# Altium schematic sheet Inverter.SchDoc (part 1 of 2)
size A3; SheetNumber: 7; SheetTotal: 9
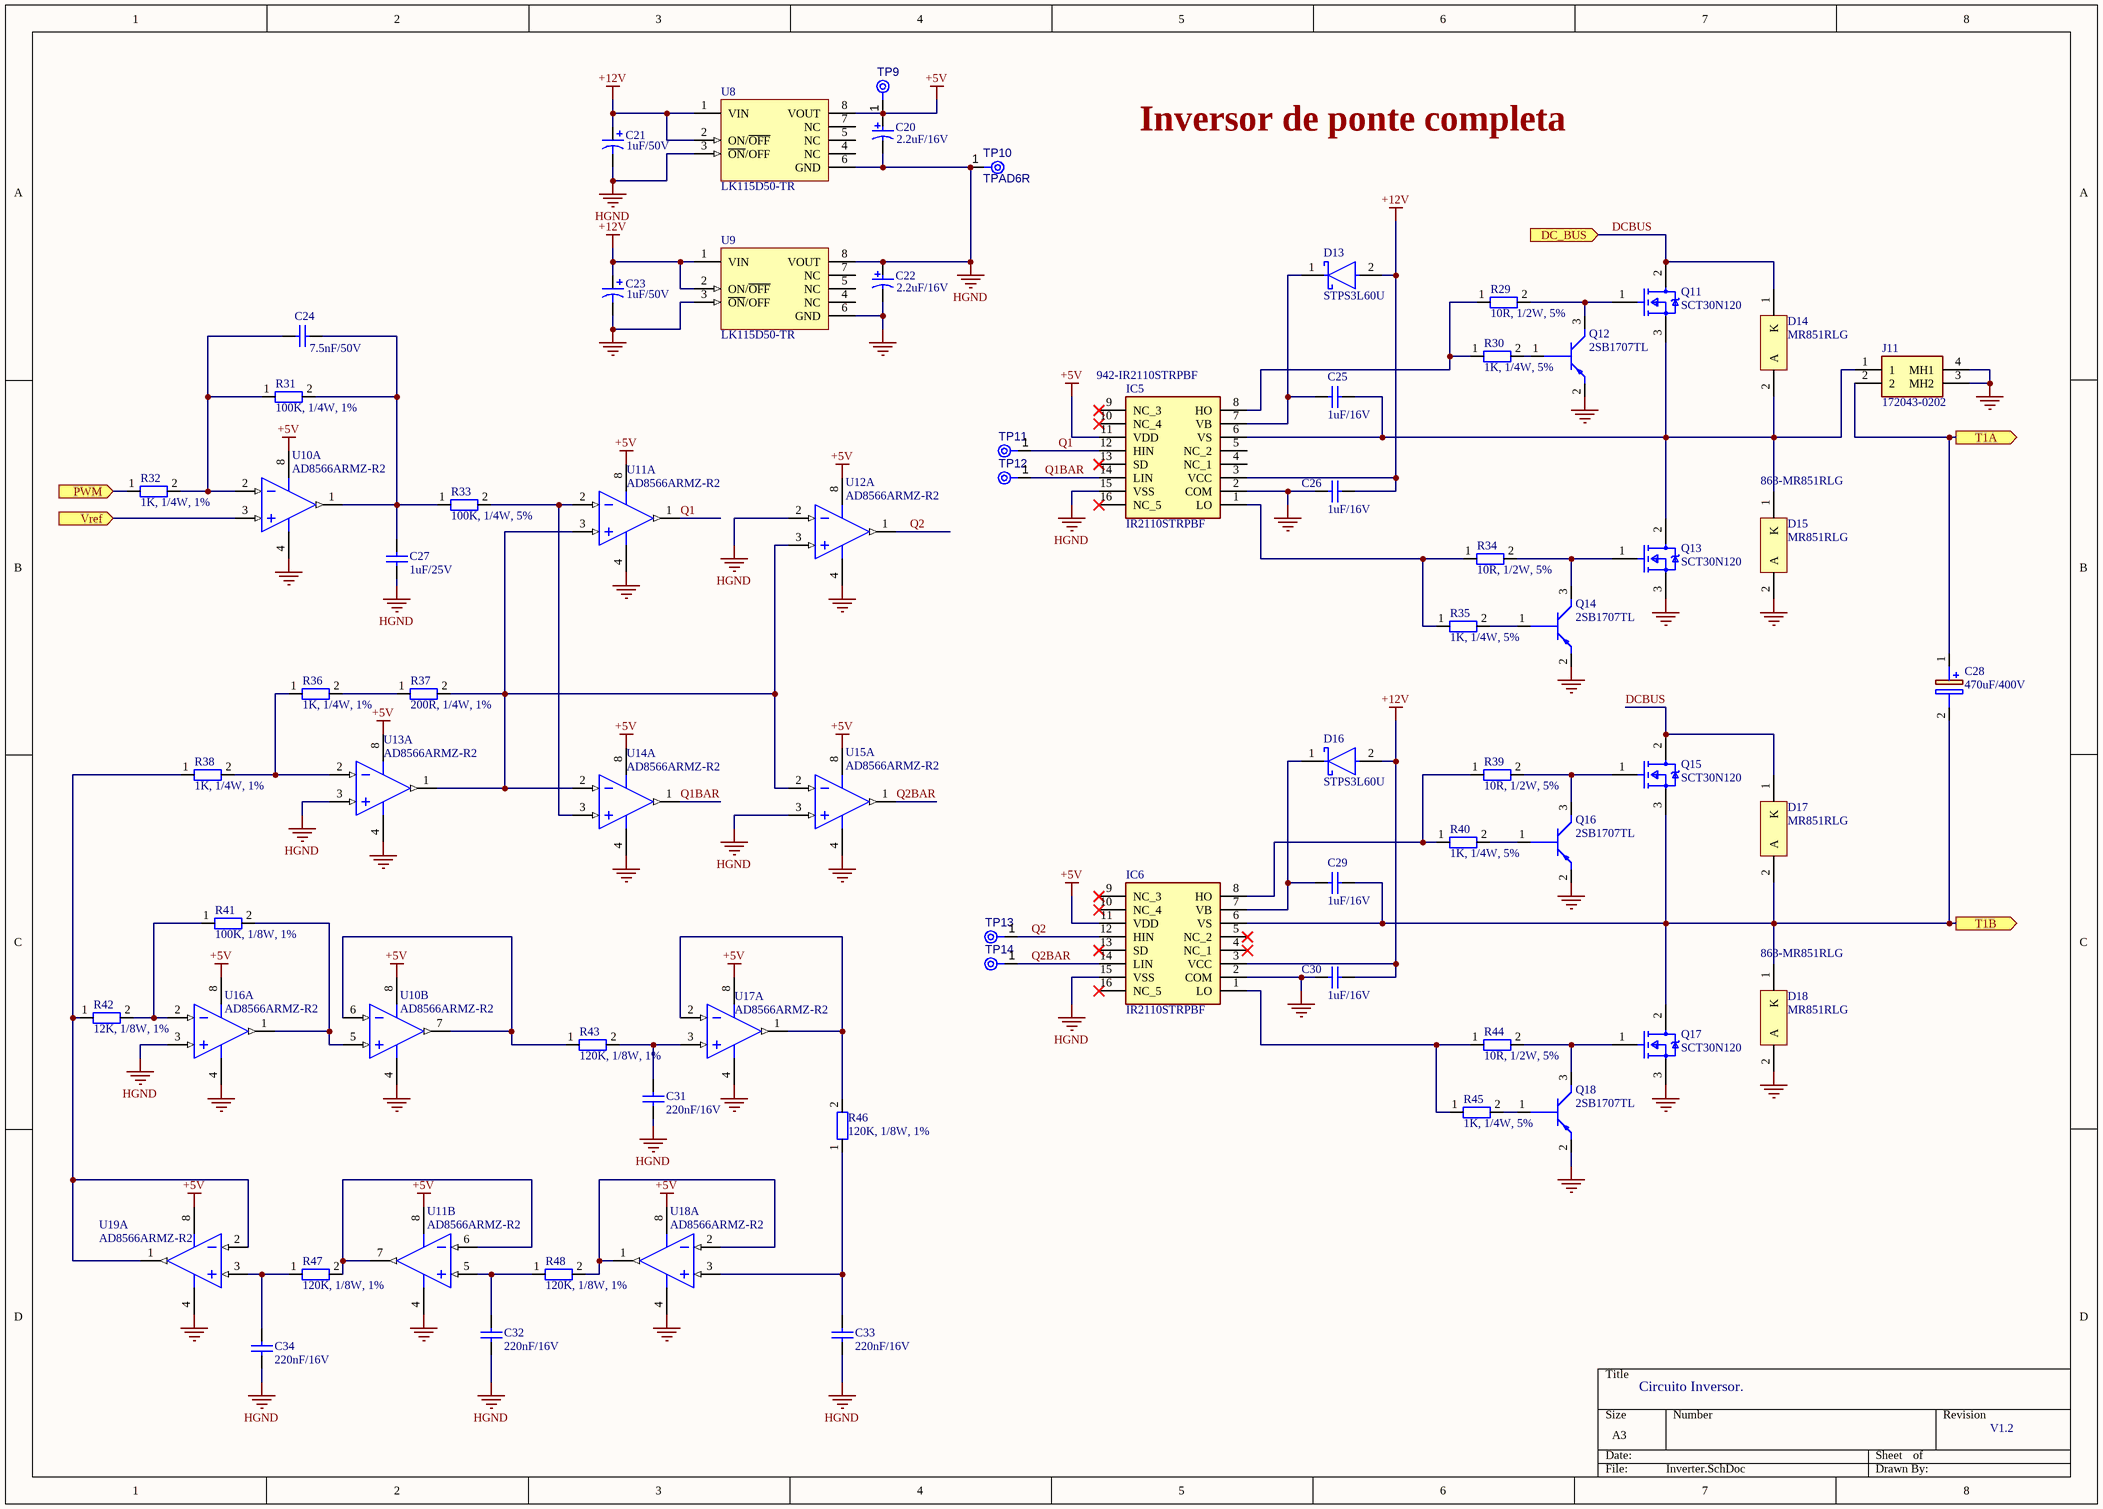
[diagram p0: Inverter.SchDoc]

## Parts
C20  2.2uF/16V  [KEMT-T491-A_L]
C21  value 1uF/50V  [C1206]  (hidden comment: Cap Pol1)
C22  2.2uF/16V  [KEMT-T491-A_L]
C23  value 1uF/50V  [C1206]  (hidden comment: Cap Pol1)
C24  7.5nF/50V  [CAPC2013X135X45LL10T25]
C25  1uF/16V  [CAPC2013X140X50ML20T25]
C26  1uF/16V  [CAPC2013X140X50ML20T25]
C27  1uF/25V  [CAPC2013X135X45LL10T25]
C28  470uF/400V  [CAPPRD1000W210D3500H3700]
C29  1uF/16V  [CAPC2013X140X50ML20T25]
C30  1uF/16V  [CAPC2013X140X50ML20T25]
C31  220nF/16V  [CAPC2013X135X45LL10T25]
C32  220nF/16V  [CAPC2013X135X45LL10T25]
C33  220nF/16V  [CAPC2013X135X45LL10T25]
C34  220nF/16V  [CAPC2013X135X45LL10T25]
D13  STPS3L60U  [FP-SMB-MFG]
D14  MR851RLG  [ONSC-AXIAL_LEAD-2-267-05_V]
D15  MR851RLG  Supplier Part Number 1: 863-MR851RLG  [ONSC-AXIAL_LEAD-2-267-05_V]
D16  STPS3L60U  [FP-SMB-MFG]
D17  MR851RLG  [ONSC-AXIAL_LEAD-2-267-05_V]
D18  MR851RLG  Supplier Part Number 1: 863-MR851RLG  [ONSC-AXIAL_LEAD-2-267-05_V]
IC5  IR2110STRPBF  Supplier Part Number 1: 942-IR2110STRPBF  [SOIC127P1032X265-16N]
IC6  IR2110STRPBF  [SOIC127P1032X265-16N]
J11  172043-0202  [1720430202]
Q11  SCT30N120  [TO-247-3]
Q12  2SB1707TL  [SOT95P280X100-3N]
Q13  SCT30N120  [TO-247-3]
Q14  2SB1707TL  [SOT95P280X100-3N]
Q15  SCT30N120  [TO-247-3]
Q16  2SB1707TL  [SOT95P280X100-3N]
Q17  SCT30N120  [TO-247-3]
Q18  2SB1707TL  [SOT95P280X100-3N]
R29  10R, 1/2W, 5%  [RESC3216X60N]
R30  1K, 1/4W, 5%  [RES-0805]
R31  100K, 1/4W, 1%  [RES-0805]
R32  1K, 1/4W, 1%  [RES-0805]
R33  100K, 1/4W, 5%  [RES-0805]
R34  10R, 1/2W, 5%  [RESC3216X60N]
R35  1K, 1/4W, 5%  [RES-0805]
R36  1K, 1/4W, 1%  [RES-0805]
R37  200R, 1/4W, 1%  [RES-0805]
R38  1K, 1/4W, 1%  [RES-0805]
R39  10R, 1/2W, 5%  [RESC3216X60N]
R40  1K, 1/4W, 5%  [RES-0805]
R41  100K, 1/8W, 1%  [RES-0805]
R42  12K, 1/8W, 1%  [RES-0805]
R43  120K, 1/8W, 1%  [RES-0805]
R44  10R, 1/2W, 5%  [RESC3216X60N]
R45  1K, 1/4W, 5%  [RES-0805]
R46  120K, 1/8W, 1%  [RES-0805]
R47  120K, 1/8W, 1%  [RES-0805]
R48  120K, 1/8W, 1%  [RES-0805]
TP9  TPAD6R  [TP06R]  (value not drawn)  (no BOM)
TP10  TPAD6R  [TP06R]  (no BOM)
TP11  TPAD6R  [TP06R]  (value not drawn)  (no BOM)
TP12  TPAD6R  [TP06R]  (value not drawn)  (no BOM)
TP13  TPAD6R  [TP06R]  (value not drawn)  (no BOM)
TP14  TPAD6R  [TP06R]  (value not drawn)  (no BOM)
U8  LK115D50-TR  [SO8_M]
U9  LK115D50-TR  [SO8_M]
U10  AD8566ARMZ-R2  [ADI-RM-8_L]  (parts A,B of 2)
U11  AD8566ARMZ-R2  [ADI-RM-8_L]  (parts A,B of 2)
U12  AD8566ARMZ-R2  [ADI-RM-8_L]  (part A of 2)
U13  AD8566ARMZ-R2  [ADI-RM-8_L]  (part A of 2)
U14  AD8566ARMZ-R2  [ADI-RM-8_L]  (part A of 2)
U15  AD8566ARMZ-R2  [ADI-RM-8_L]  (part A of 2)
U16  AD8566ARMZ-R2  [ADI-RM-8_L]  (part A of 2)
U17  AD8566ARMZ-R2  [ADI-RM-8_L]  (part A of 2)
U18  AD8566ARMZ-R2  [ADI-RM-8_L]  (part A of 2)
U19  AD8566ARMZ-R2  [ADI-RM-8_L]  (part A of 2)

## Ports
DC_BUS (in), PWM (in), T1A (out), T1B (out), Vref (in)

## Nets
+5V: C20.1 IC5.11(VDD) IC6.11(VDD) TP9.1(TP) U8.8(VOUT) U10.8(+V) U11.8(+V) U12.8(+V) U13.8(+V) U14.8(+V) U15.8(+V) U16.8(+V) U17.8(+V) U18.8(+V) U19.8(+V)
+12V: C21.1 C23.1 C26.2 C30.1 D13.2(A) D16.2(A) IC5.3(VCC) IC6.3(VCC) U8.1(VIN) U8.2(ON/~{OFF}) U9.1(VIN) U9.2(ON/~{OFF})
GND: C22.2 C23.2 C26.1 C30.2 D15.2(A) D18.2(A) IC5.2(COM) IC6.2(COM) J11.3(MH2) J11.4(MH1) Q12.2(E) Q13.3(S) Q14.2(E) Q16.2(E) Q17.3(S) Q18.2(E) U9.3(~{ON}/OFF) U9.6(GND) U10.4(-V) U11.4(-V) U12.4(-V) U13.4(-V) U14.4(-V) U15.4(-V) U16.4(-V) U17.4(-V) U18.4(-V) U19.4(-V)
HGND: C20.2 C21.2 C22.1 C27.1 C31.1 C32.1 C33.1 C34.1 IC5.15(VSS) IC6.15(VSS) TP10.1(TP) U8.3(~{ON}/OFF) U8.6(GND) U9.8(VOUT) U12.2(-IN_A) U13.3(+IN_A) U15.3(+IN_A) U16.3(+IN_A)
DCBUS: D14.1(K) D17.1(K) Q11.2(D) Q15.2(D) ; port DC_BUS
PWM: R32.1 ; port PWM
Q1: IC5.12(HIN) TP11.1(TP) U11.1(OUT_A)
Q1BAR: IC5.14(LIN) TP12.1(TP) U14.1(OUT_A)
Q2: IC6.12(HIN) TP13.1(TP) U12.1(OUT_A)
Q2BAR: IC6.14(LIN) TP14.1(TP) U15.1(OUT_A)
T1A: C28.1(+) J11.2 ; port T1A
T1B: C28.2(-) C29.1 D17.2(A) D18.1(K) IC6.6(VS) Q15.3(S) Q17.2(D) ; port T1B
Vref: U10.3(+IN_A) ; port Vref
NetC24_1: C24.1 C27.2 R31.2 R33.1 U10.1(OUT_A)
NetC24_2: C24.2 R31.1 R32.2 U10.2(-IN_A)
NetC25_1: C25.1 D13.1(K) IC5.7(VB)
NetC25_2: C25.2 D14.2(A) D15.1(K) IC5.6(VS) J11.1 Q11.3(S) Q13.2(D)
NetC29_2: C29.2 D16.1(K) IC6.7(VB)
NetC31_2: C31.2 R43.2 U17.3(+IN_A)
NetC32_2: C32.2 R48.1 U11.5(+IN_B)
NetC33_2: C33.2 R46.1 U18.3(+IN_A)
NetC34_2: C34.2 R47.1 U19.3(+IN_A)
NetIC5_1: IC5.1(LO) R34.1 R35.1
NetIC5_8: IC5.8(HO) R29.1 R30.1
NetIC6_1: IC6.1(LO) R44.1 R45.1
NetIC6_8: IC6.8(HO) R39.1 R40.1
NetQ11_1: Q11.1(G) Q12.3(C) R29.2
NetQ12_1: Q12.1(B) R30.2
NetQ13_1: Q13.1(G) Q14.3(C) R34.2
NetQ14_1: Q14.1(B) R35.2
NetQ15_1: Q15.1(G) Q16.3(C) R39.2
NetQ16_1: Q16.1(B) R40.2
NetQ17_1: Q17.1(G) Q18.3(C) R44.2
NetQ18_1: Q18.1(B) R45.2
NetR33_2: R33.2 U11.2(-IN_A) U14.3(+IN_A)
NetR36_1: R36.1 R38.2 U13.2(-IN_A)
NetR36_2: R36.2 R37.1
NetR37_2: R37.2 U11.3(+IN_A) U12.3(+IN_A) U13.1(OUT_A) U14.2(-IN_A) U15.2(-IN_A)
NetR38_1: R38.1 R42.1 U19.1(OUT_A) U19.2(-IN_A)
NetR41_1: R41.1 R42.2 U16.2(-IN_A)
NetR41_2: R41.2 U10.5(+IN_B) U16.1(OUT_A)
NetR43_1: R43.1 U10.6(-IN_B) U10.7(OUT_B)
NetR46_2: R46.2 U17.1(OUT_A) U17.2(-IN_A)
NetR47_2: R47.2 U11.6(-IN_B) U11.7(OUT_B)
NetR48_2: R48.2 U18.1(OUT_A) U18.2(-IN_A)

Not connected (* = marked no-connect by the designer): IC5 4(NC_1) 5(NC_2) 9(NC_3)* 10(NC_4)* 13(SD)* 16(NC_5)*; IC6 4(NC_1)* 5(NC_2)* 9(NC_3)* 10(NC_4)* 13(SD)* 16(NC_5)*; U8 4(NC) 5(NC) 7(NC); U9 4(NC) 5(NC) 7(NC)

## Notes on the sheet
- Inversor de ponte completa
- Circuito Inversor.
- V1.2